# Altium schematic sheet Auxiliary.SchDoc
size A3
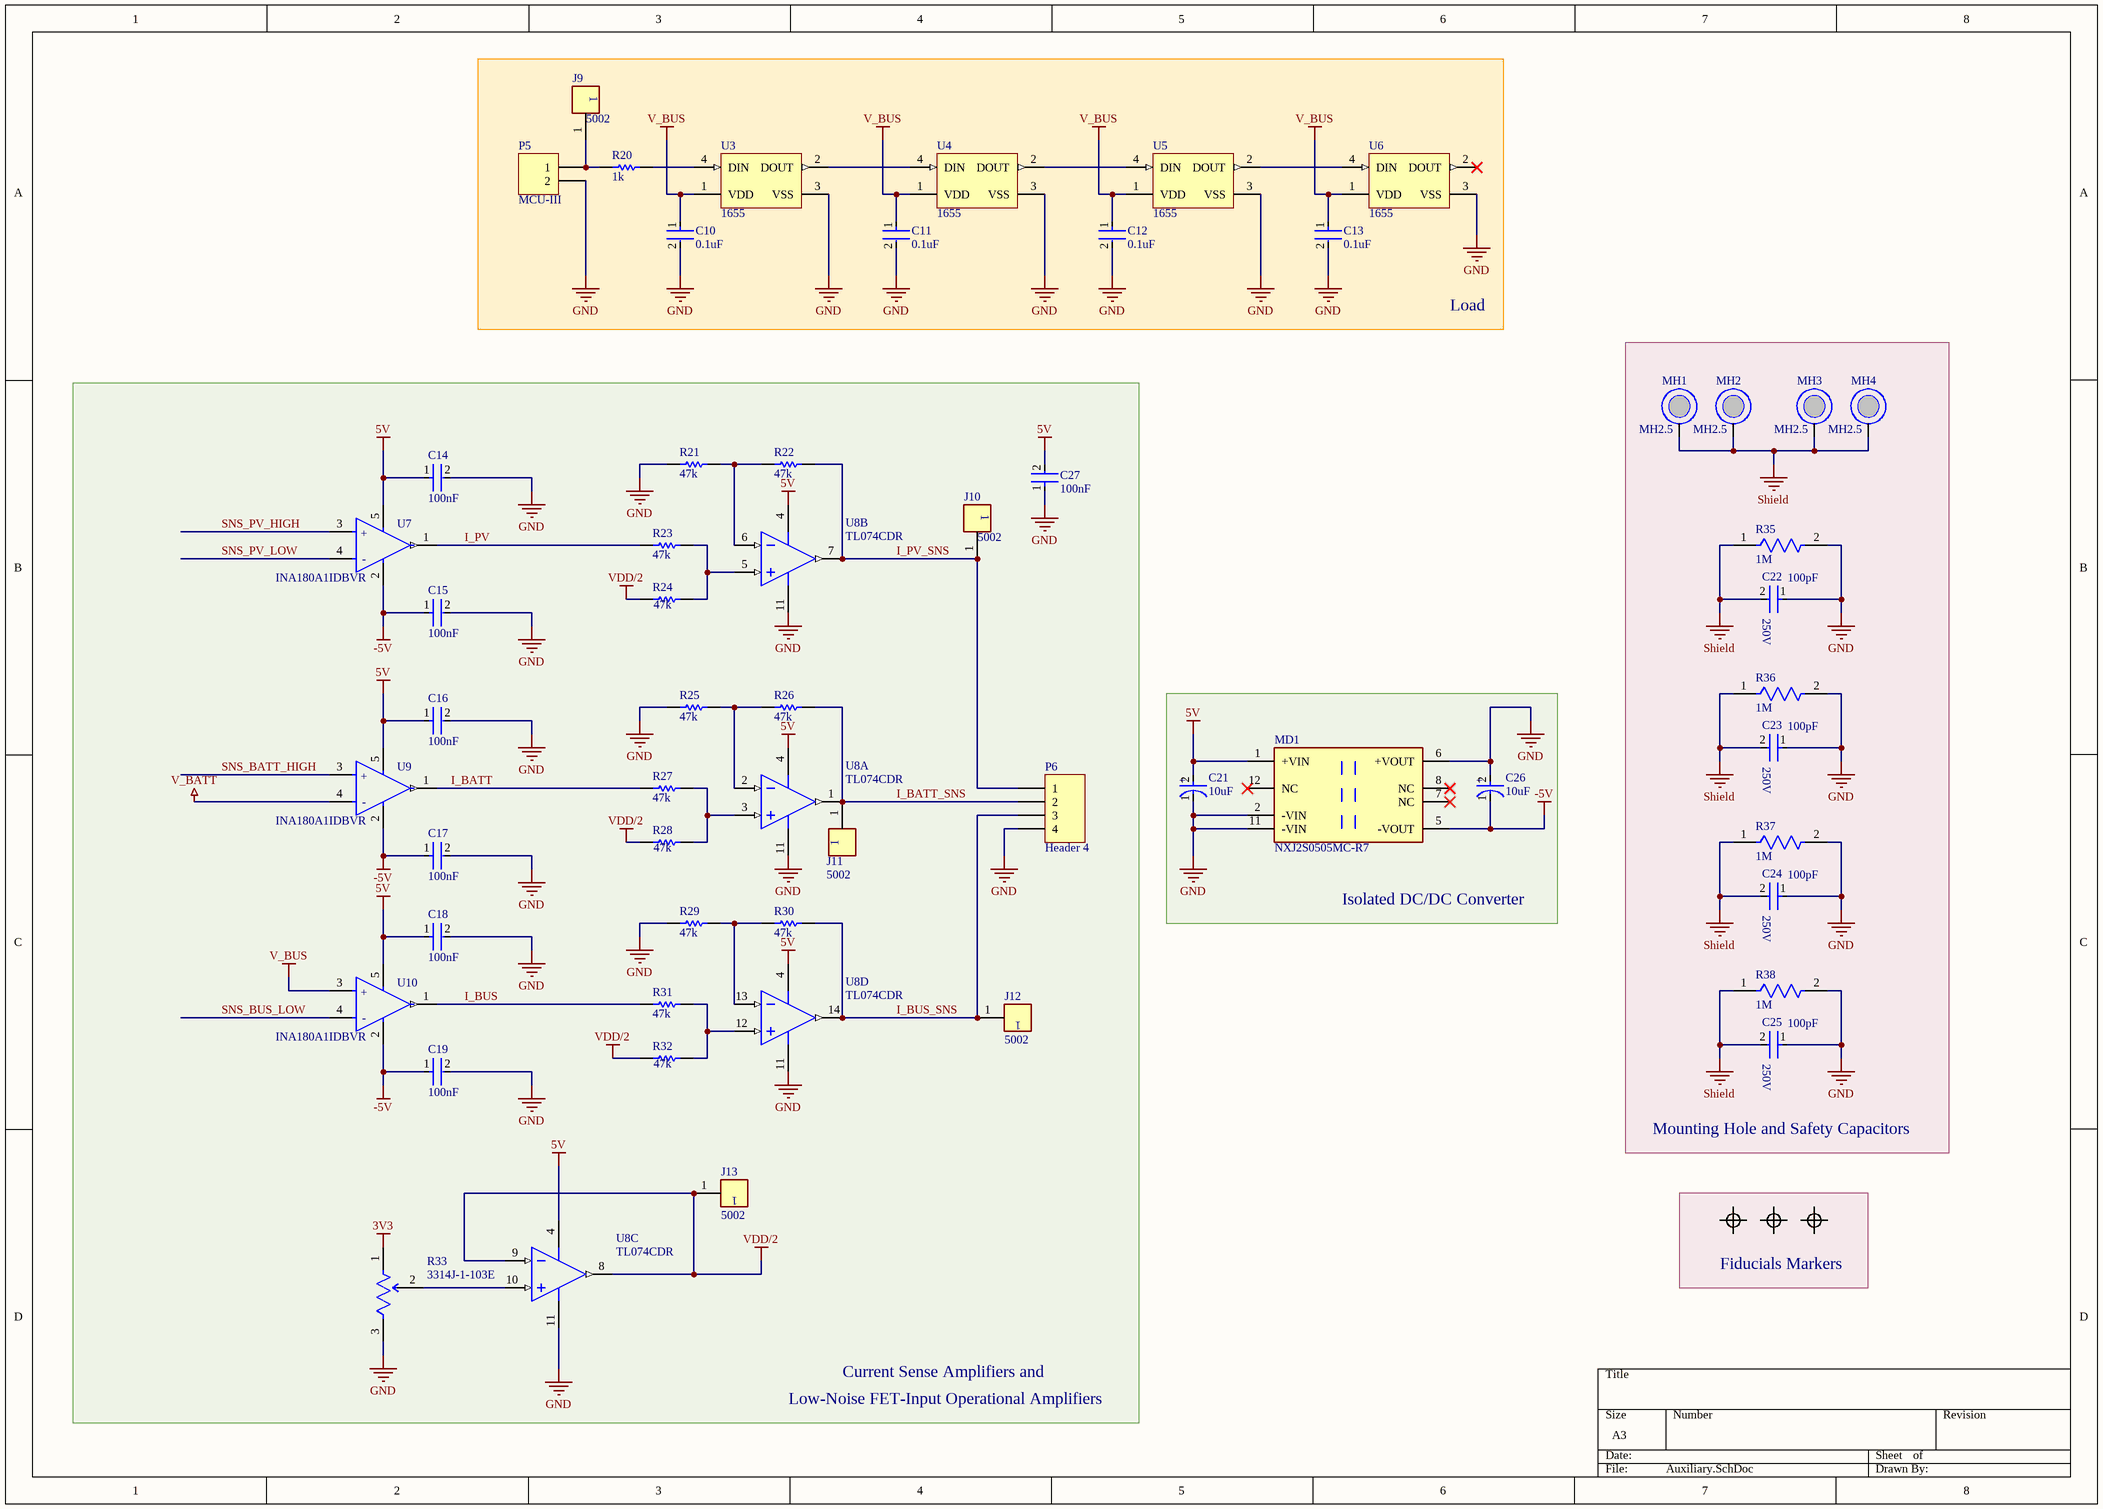
[diagram p0: Auxiliary.SchDoc]

## Parts
C10  0.1uF  [FP-GRM155-0_05-MFG]
C11  0.1uF  [FP-GRM155-0_05-MFG]
C12  0.1uF  [FP-GRM155-0_05-MFG]
C13  0.1uF  [FP-GRM155-0_05-MFG]
C14  100nF  [FP-CGA3E-0_3-0_1-IPC_A]
C15  100nF  [FP-CGA3E-0_3-0_1-IPC_A]
C16  100nF  [FP-CGA3E-0_3-0_1-IPC_A]
C17  100nF  [FP-CGA3E-0_3-0_1-IPC_A]
C18  100nF  [FP-CGA3E-0_3-0_1-IPC_A]
C19  100nF  [FP-CGA3E-0_3-0_1-IPC_A]
C21  10uF  [FP-T491C106K016AT-MFG]
C22  100pF  [FP-GA342Q-0_3-e0_3_1_15-IPC_C]
C23  100pF  [FP-GA342Q-0_3-e0_3_1_15-IPC_C]
C24  100pF  [FP-GA342Q-0_3-e0_3_1_15-IPC_C]
C25  100pF  [FP-GA342Q-0_3-e0_3_1_15-IPC_C]
C26  10uF  [FP-T491C106K016AT-MFG]
C27  100nF  [FP-CGA3E-0_3-0_1-IPC_A]
F1  FIDUCIAL  [FIDUCIAL]  (value not drawn)  (no BOM)
F2  FIDUCIAL  [FIDUCIAL]  (value not drawn)  (no BOM)
F3  FIDUCIAL  [FIDUCIAL]  (value not drawn)  (no BOM)
J9  5002  [FP-5002-MFG]
J10  5002  [FP-5002-MFG]
J11  5002  [FP-5002-MFG]
J12  5002  [FP-5002-MFG]
J13  5002  [FP-5002-MFG]
MD1  NXJ2S0505MC-R7  [FP-NXJ2SM-MFG]
MH1  MH2.5  [Mounting Hole]
MH2  MH2.5  [Mounting Hole]
MH3  MH2.5  [Mounting Hole]
MH4  MH2.5  [Mounting Hole]
P5  MCU-III  [HDR1X2]
P6  Header 4  [HDR1X4]
R20  1k  [RESC1608X55X30LL15T15]
R21  47k  [RESC1608X55X30NL15T15]
R22  47k  [RESC1608X55X30NL15T15]
R23  47k  [RESC1608X55X30NL15T15]
R24  47k  [RESC1608X55X30NL15T15]
R25  47k  [RESC1608X55X30NL15T15]
R26  47k  [RESC1608X55X30NL15T15]
R27  47k  [RESC1608X55X30NL15T15]
R28  47k  [RESC1608X55X30NL15T15]
R29  47k  [RESC1608X55X30NL15T15]
R30  47k  [RESC1608X55X30NL15T15]
R31  47k  [RESC1608X55X30NL15T15]
R32  47k  [RESC1608X55X30NL15T15]
R33  3314J-1-103E  [FP-3314J-1-MFG]
R35  1M  [FP-CRCW0603C-e3-MFG]
R36  1M  [FP-CRCW0603C-e3-MFG]
R37  1M  [FP-CRCW0603C-e3-MFG]
R38  1M  [FP-CRCW0603C-e3-MFG]
U3  1655  [ADA-RGB-1655_V]
U4  1655  [ADA-RGB-1655_V]
U5  1655  [ADA-RGB-1655_V]
U6  1655  [ADA-RGB-1655_V]
U7  INA180A1IDBVR  [FP-DBV0005A-IPC_A]
U8  TL074CDR  [D0014A_N]  (parts A,B,C,D of 4)
U9  INA180A1IDBVR  [FP-DBV0005A-IPC_A]
U10  INA180A1IDBVR  [FP-DBV0005A-IPC_A]

## Blocks framed on the sheet
Load: C10-C13 J9 P5 R20 U3-U6
Mounting Hole and Safety Capacitors: C22-C25 MH1-MH4 R35-R38
Isolated DC/DC Converter: C21 C26 MD1
Fiducials Markers: F1-F3

## Nets
3V3: R33.1(CCW)
5V: C14.1 C16.1 C18.1 C21.2(A) C27.2 MD1.1(+VIN) U7.5(VS) U8.4(VCC+) U9.5(VS) U10.5(VS)
-5V: C15.1 C17.1 C19.1 C26.1(C) MD1.5(-VOUT) U7.2(GND) U9.2(GND) U10.2(GND)
GND: C10.2 C11.2 C12.2 C13.2 C14.2 C15.2 C16.2 C17.2 C18.2 C19.2 C21.1(C) C22.1 C23.1 C24.1 C25.1 C26.2(A) C27.1 MD1.2(-VIN) MD1.6(+VOUT) MD1.11(-VIN) P5.2 P6.4 R21.2 R25.2 R29.2 R33.3(CW) R35.2 R36.2 R37.2 R38.2 U3.3(VSS) U4.3(VSS) U5.3(VSS) U6.3(VSS) U8.11(VCC-)
Shield: C22.2 C23.2 C24.2 C25.2 MH1.1 MH2.1 MH3.1 MH4.1 R35.1 R36.1 R37.1 R38.1
V_BATT: U9.4(IN-)
V_BUS: C10.1 C11.1 C12.1 C13.1 U3.1(VDD) U4.1(VDD) U5.1(VDD) U6.1(VDD) U10.3(IN+)
VDD/2: J13.1 R24.2 R28.2 R32.2 U8.8(OUT3) U8.9(IN3-)
I_BATT: R27.2 U9.1(OUT)
I_BATT_SNS: J11.1 P6.2 R26.1 U8.1(OUT1)
I_BUS: R31.2 U10.1(OUT)
I_BUS_SNS: J12.1 P6.3 R30.1 U8.14(OUT4)
I_PV: R23.2 U7.1(OUT)
I_PV_SNS: J10.1 P6.1 R22.1 U8.7(OUT2)
SNS_BATT_HIGH: U9.3(IN+)
SNS_BUS_LOW: U10.4(IN-)
SNS_PV_HIGH: U7.3(IN+)
SNS_PV_LOW: U7.4(IN-)
NetJ9_1: J9.1 P5.1 R20.2
NetR20_1: R20.1 U3.4(DIN)
NetR21_1: R21.1 R22.2 U8.6(IN2-)
NetR23_1: R23.1 R24.1 U8.5(IN2+)
NetR25_1: R25.1 R26.2 U8.2(IN1-)
NetR27_1: R27.1 R28.1 U8.3(IN1+)
NetR29_1: R29.1 R30.2 U8.13(IN4-)
NetR31_1: R31.1 R32.1 U8.12(IN4+)
NetR33_2: R33.2(WIPER) U8.10(IN3+)
NetU3_2: U3.2(DOUT) U4.4(DIN)
NetU4_2: U4.2(DOUT) U5.4(DIN)
NetU5_2: U5.2(DOUT) U6.4(DIN)

Not connected (* = marked no-connect by the designer): MD1 7(NC)* 8(NC)* 12(NC)*; U6 2(DOUT)*

## Notes on the sheet
- Current Sense Amplifiers and
- Low-Noise FET-Input Operational Amplifiers
- (in symbol CMP-2000-07197-3) +
- (in symbol CMP-04895-000140-1) +; -

## Library data of the parts
C10-C13 = CMP-2008-04599-2: CAP CER 0.1UF 16V X7R 0402; Tolerance: 5%; Capacitance: 100nF; Height: 0.5mm; Min Operating Temperature: -55°C; Voltage Rating: 16V; Termination: Standard; Dielectric: X7R; Max Operating Temperature: 125°C; Package Quantity: 10000; Case/Package: 0402; Case Code (Metric): 1005; Depth: 0.5mm; Voltage: 16V; Width: 0.5mm; RoHS Compliant: Yes; Length: 1mm; Case Code (Imperial): 0402; Thickness: 0.022inch; Mount: Surface Mount; REACH SVHC: No SVHC; Weight: 0.000212oz; Voltage Rating (DC): 16V; Series: GRM; Packaging: Cut Tape; Radiation Hardening: No; Lead Free: Lead Free
C14-C19 C27 = CMP-2000-07546-2: Cap Ceramic 100nF 50V X7R 10% Pad SMD 0603 +125°C Automotive T/R; Weight: 7.1E-05oz; Composition: Ceramic; Max Operating Temperature: 125°C; Termination: SMD/SMT; Dielectric: X7R; Length: 1.6mm; Package Quantity: 1; REACH SVHC: No SVHC; Lead Free: Lead Free; Case Code (Metric): 1608; Min Operating Temperature: -55°C; Packaging: Tape and Reel; Tolerance: 10%; Voltage Rating: 50V; Case Code (Imperial): 0603; Capacitance: 100nF; Case/Package: 0603; Voltage Rating (DC): 50V; Depth: 0.8mm; Radiation Hardening: No; Ratings: AEC-Q200; Mount: Surface Mount; Voltage: 50V; Thickness: 0.035inch; Width: 0.8mm; Height: 0.8mm
C21 C26 = CMP-2000-07197-3: CAP TANT 10UF 10% 16V 2312; Dielectric Material: Tantalum; Polarity: Polar; Dissipation Factor: 6%; Leakage Current: 1.6uA; Ripple Current: 247mA; Life (Hours): 2000Hour; ESR (Equivalent Series Resistance): 1.8R; Height: 2.5mm; Length: 6mm; Min Operating Temperature: -55°C; Case/Package: Molded; Voltage: 16V; Height - Seated (Max): 0.11inch; Package Quantity: 1; RoHS Compliant: Yes; Termination: SMD/SMT; REACH SVHC: No SVHC; Case Code (Imperial): 2312; Tolerance: 10%; Capacitance: 10uF; Voltage Rating (DC): 16V; Mount: Surface Mount; Radiation Hardening: No; Case Code (Metric): 6032; Packaging: Tape and Reel; Depth: 3.2mm; Width: 3.2mm; Max Operating Temperature: 125°C; Features: General Purpose; Voltage Rating: 16V; Lead Free: Lead Free
C22-C25 = CMP-06035-060818-1: 100pF ±10%  250VAC Ceramic Capacitor X7R 1808 (4520 Metric); Voltage Rating (AC): 250V; Mount: Surface Mount; Height: 1.5mm; Radiation Hardening: No; Min Operating Temperature: -55°C; Dielectric: X7R; Voltage Rating (DC): 250V; Voltage: 250V; Max Operating Temperature: 125°C; Number of Pins: 2; Capacitance: 100pF; Case/Package: 1808; Voltage Rating: 250V; Tolerance: 10%; REACH SVHC: No SVHC; Case Code (Imperial): 1808; Lead Free: Lead Free; Depth: 2mm; Termination: SMD/SMT; Width: 0.079inch; Package Quantity: 2000; Thickness: 0.059inch; Packaging: Tape and Reel; Length: 4.5mm; Case Code (Metric): 4520
J9-J13 = CMP-2000-05182-2: PC TEST POINT MINIATURE WHITE; Body Material: Bronze; Insulation: Insulated; Inside Diameter: 1.27mm; Number of Ports: 1; Outside Diameter: 2.54mm; Hole Diameter: 1.6mm; Plating: Silver; Contact Plating: Silver; Orientation: Straight; REACH SVHC: No SVHC; Series: THM; Packaging: Bulk; Material: Nylon; Flammability Rating: UL94 V-0; Mount: Through Hole; Color: White; Housing Color: White; Length: 7.62mm; Contact Material: Bronze; Lead Free: Lead Free; Package Quantity: 100; RoHS Compliant: Yes
MD1 = CMP-20596-000009-1: DC DC CONVERTER 5V 2W; RoHS Compliant: Yes
MH1-MH4 = Mounting Hole
P5 = Header 2: Header, 2-Pin; LatestRevisionDate: 17-Jul-2002; LatestRevisionNote: Re-released for DXP Platform.; Publisher: Altium Limited
P6 = Header 4: Header, 4-Pin; LatestRevisionDate: 17-Jul-2002; LatestRevisionNote: Re-released for DXP Platform.; Publisher: Altium Limited
R20 = CMP-2000-00180-1: Part Number: ERJ-3EKF1001V; Manufacturer: Panasonic
R21-R32 = CMP-2000-00523-2: Chip Resistor, 47 KOhm, +/- 1%, 0.1 W, -55 to 155 degC, 0603 (1608 Metric), RoHS, Tape and Reel; Case\Package: 0603; Forward Current: 20 mA; Power Rating: 90 mW; Illumination Colour: Red; Nominal Vf: 2.1 V; Viewing Angle: 160 degrees; Luminous Intensity: 63 mcd; Lens Style: Clear; Nominal Wavelength: 639 nm; Case Code (Imperial): 0603; Case Code (Metric): 1608; Packaging: Tape and Reel; Radiation Hardening: No; Colour: Red; PackageDescription: 2-Pin Surface Mount Device, Body 1.6 x 0.85 mm; ComponentLink1Description: Manufacturer URL; Width: 0.8 mm; DatasheetVersion: Apr-15; ComponentLink2URL: http://industrial.panasonic.com/cdbs/www-data/pdf/RDA0000/AOA0000C86.pdf; Min Operating Temperature: -40 degC; Height: 0.6 mm; Package Quantity: 3000; ComponentLink2Description: Datasheet; REACH SVHC: No SVHC; ComponentLink1URL: http://www.panasonic.com/; Mount: Surface Mount; RoHSCompliant: true; Max Operating Temperature: 100 degC; PackageReference: 0603; Length: 1.6 mm; Forward Voltage: 2.1 V; Pins: 2
R33 = CMP-07234-000035-1: TRIMMER 10K OHM 0.25W J LEAD TOP; RoHS Compliant: Yes
R35-R38 = CMP-02407-000053-1: RES 1M OHM 1% 1/10W 0603; Resistance: 1MR; Temperature Coefficient: 100ppm/°C; Power Rating: 100mW; Lead Free: Lead Free; Tolerance: 1%; Case/Package: Molded; Min Operating Temperature: -55°C; Mount: Surface Mount; Length: 1.55mm; Termination: Wraparound; Composition: Thick Film; Max Operating Temperature: 155°C; Contact Plating: Tin
U3-U6 = CMP-2000-05026-1: Intelligent Control LED Integrated Light Source, 3.5 to 5.3 V, -25 to 80 degC, 4-Pin SMD, RoHS, Tape and Reel; Manufacturer: Adafruit-Industries-LLC; Number of LEDs: 10; Configuration: Discrete; Utilized LED: WS2812(5050); Datasheet URL: http://datasheet.octopart.com/ADA1655-Adafruit-Industries-datasheet-32028139.pdf; Series: Neopixel; Interface: -; Package Description: 4-Pin Surface Mount Device, Body 5 x 5 mm; Color: Red,Green,Blue(RGB); Category: Optoelectronics; Controller Type: -; Package Reference: 1655; Manufacturer URL: https://www.adafruit.com/; Mounting Type: SurfaceMount; Datasheet Version: May-13; Size / Dimension: 5.00mmLx5.00mmW; Family: Addressable,Specialty
U7 U9 U10 = CMP-04895-000140-1: IC CURR SENSE 1 CIRCUIT SOT23-5; Input Bias Current: 100nA; Input Offset Voltage (Vos): 100uV; Number of Circuits: 1; Slew Rate: 2V/µs; -3db Bandwidth: 350kHz; Operating Supply Current: 260uA; Case/Package: SOT-23-5; Min Operating Temperature: -40°C; Mount: Surface Mount; Packaging: Tape and Reel; Max Operating Temperature: 125°C
U8 = CMP-0017-00003-2: Quad Low-Noise JFET-Input General-Purpose Operational Amplifier, 7 to 36 V, 0 to 70 degC, 14-pin SOIC (D14), Green (RoHS & no Sb/Br); Manufacturer: Texas Instruments; Slew Rate(Typ)(V/us): 13; IIB(Max)(pA): 200; Number of Channels: 4; CMRR(Min)(dB): 70; Vn at 1kHz(Typ)(nV/rtHz): 18; Vio (25C)(Max)(mV): 10; Sub Family: General Purpose Amplifier, High Supply Voltage Amplifier (>=30V); Total Supply Voltage(Max)(+5V is 5, +/-5V is 10): 36; Total Supply Voltage(Min)(+5V is 5, +/-5V is 10): 7; GBW(Typ)(MHz): 3; Rating: Military; Iq per channel(Max)(mA): 2.5; Eco-Plan: Green (RoHS & no Sb/Br); ComponentLink3Description: Package Specification; ComponentLink1URL: http://www.ti.com/; Mounting Technology: Surface Mount; ComponentLink3URL: http://www.ti.com/lit/ml/mpds177g/mpds177g.pdf; PartNumber: TL074CDR; DatasheetVersion: SLOS080J; ComponentLink2URL: http://www.ti.com/lit/ds/symlink/tl074.pdf; ComponentLink1Description: Manufacturer URL; PackageVersion: 4040047-5/M, 06/2011; PackageReference: D0014A; Code_JEDEC: MS-012; ComponentLink2Description: Datasheet; Offset Drift(Typ)(uV/C): 18; PackageDescription: 14-Pin Plastic Small Outline, Body 8.65 x 3.90 mm, Pitch 1.27 mm
F1-F3 = FIDUCIAL: ComponentLink2Description: *; ComponentLink2URL: *; EKS: *; Manufacturer: *; ManufacturerPN: *; ComponentLink1Description: *; ComponentLink1URL: *